# Altium schematic sheet Minsystem_LG.SchDoc
size A4
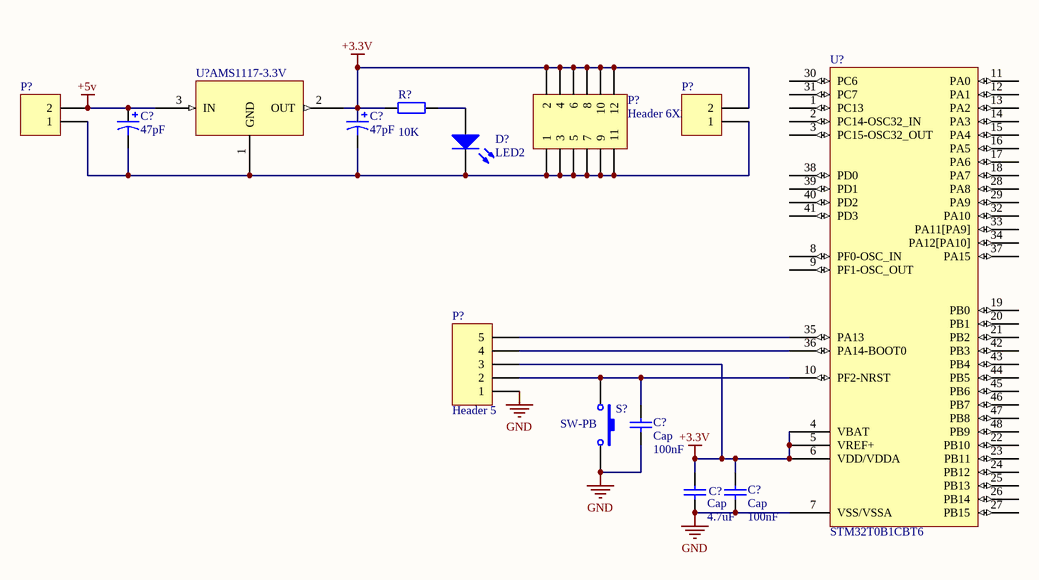
[diagram p0: Minsystem_LG.SchDoc]

## Parts
(Parts that share a designator on the sheet are numbered #1, #2 ... from top to bottom, then left to right.)
C?#1  value 47pF  [RB7.6-15]  (hidden comment: Cap Pol1)
C?#2  value 47pF  [RB7.6-15]  (hidden comment: Cap Pol1)
C?#3  Cap  value 100nF  [RAD-0.3]
C?#4  Cap  value 4.7uF  [RAD-0.3]
C?#5  Cap  value 100nF  [RAD-0.3]
D?  LED2  [DSO-F2/D6.1]
P?#1  Header 2  [HDR1X2]  (value not drawn)
P?#2  Header 2  [HDR1X2]  (value not drawn)
P?#3  Header 6X2  [HDR2X6]
P?#4  Header 5  [HDR1X5]
R?  value 10K  [AXIAL-0.4]  (hidden comment: Res2)
S?  SW-PB  [SPST-2]
U?#1  STM32T0B1CBT6  [TQFP48_N]
U?#2  AMS1117-3.3V  [KTE03]

## Nets
+3.3V: C?#2.1 C?#4.1 C?#5.1 P?#2.2 P?#3.2 P?#3.4 P?#3.6 P?#3.8 P?#3.10 P?#3.12 P?#4.3 R?.1 U?#1.4(VBAT) U?#1.5(VREF+) U?#1.6(VDD/VDDA) U?#2.2(OUT)
+5v: C?#1.1 P?#1.2 U?#2.3(IN)
GND: C?#3.2 C?#4.2 C?#5.2 P?#4.1 S?.2 U?#1.7(VSS/VSSA)
NetC?#1_2: C?#1.2 C?#2.2 D?.2(K) P?#1.1 P?#2.1 P?#3.1 P?#3.3 P?#3.5 P?#3.7 P?#3.9 P?#3.11 U?#2.1(GND)
NetC?#3_1: C?#3.1 P?#4.2 S?.1 U?#1.10(PF2-NRST)
NetD?_1: D?.1(A) R?.2
NetP?#4_4: P?#4.4 U?#1.36(PA14-BOOT0)
NetP?#4_5: P?#4.5 U?#1.35(PA13)

Not connected (* = marked no-connect by the designer): U?#1 1(PC13) 2(PC14-OSC32_IN) 3(PC15-OSC32_OUT) 8(PF0-OSC_IN) 9(PF1-OSC_OUT) 11(PA0) 12(PA1) 13(PA2) 14(PA3) 15(PA4) 16(PA5) 17(PA6) 18(PA7) 19(PB0) 20(PB1) 21(PB2) 22(PB10) 23(PB11) 24(PB12) 25(PB13) 26(PB14) 27(PB15) 28(PA8) 29(PA9) 30(PC6) 31(PC7) 32(PA10) 33(PA11[PA9]) 34(PA12[PA10]) 37(PA15) 38(PD0) 39(PD1) 40(PD2) 41(PD3) 42(PB3) 43(PB4) 44(PB5) 45(PB6) 46(PB7) 47(PB8) 48(PB9)

## Library data of the parts
C?#1 C?#2 = Cap Pol1: Polarized Capacitor (Radial); Published: 8-Jun-2000; LatestRevisionDate: 17-Jul-2002; LatestRevisionNote: Re-released for DXP Platform.; PackageReference: RB7.6-15; Publisher: Altium Limited
C?#3-C?#5 = Cap: Capacitor; Published: 8-Jun-2000; LatestRevisionDate: 17-Jul-2002; LatestRevisionNote: Re-released for DXP Platform.; PackageReference: RAD-0.3; Publisher: Altium Limited
D? = LED2: Typical RED, GREEN, YELLOW, AMBER GaAs LED; Published: 8-Jun-2000; LatestRevisionDate: 17-Jul-2002; LatestRevisionNote: Re-released for DXP Platform.; PackageVersion: Feb-2002; PackageReference: 3.2X1.6X1.1; Publisher: Altium Limited
P?#1 P?#2 = Header 2: Header, 2-Pin; LatestRevisionDate: 17-Jul-2002; LatestRevisionNote: Re-released for DXP Platform.; Publisher: Altium Limited
P?#3 = Header 6X2: Header, 6-Pin, Dual row; LatestRevisionDate: 17-Jul-2002; LatestRevisionNote: Re-released for DXP Platform.; Publisher: Altium Limited
P?#4 = Header 5: Header, 5-Pin; LatestRevisionDate: 17-Jul-2002; LatestRevisionNote: Re-released for DXP Platform.; Publisher: Altium Limited
R? = Res2: Resistor; Published: 8-Jun-2000; LatestRevisionDate: 17-Jul-2002; LatestRevisionNote: Re-released for DXP Platform.; PackageReference: AXIAL-0.4; Publisher: Altium Limited
S? = SW-PB: Switch; Published: 24-Mar-1999; LatestRevisionDate: 17-Jul-2002; LatestRevisionNote: Re-released for DXP Platform.; PackageReference: SPST-2; Publisher: Altium Limited
U?#1 = STM32T0B1CBT6_LG: Arm Cortex?-M0+ 32-bit MCU, 128KB Flash, 144KB RAM
U?#2 = AMS1117-3.3V: 1A LOW DROPOUT VOLTAGE REGULATOR